# Altium schematic sheet reader.SchDoc
size A3; SheetNumber: 1; SheetTotal: 1
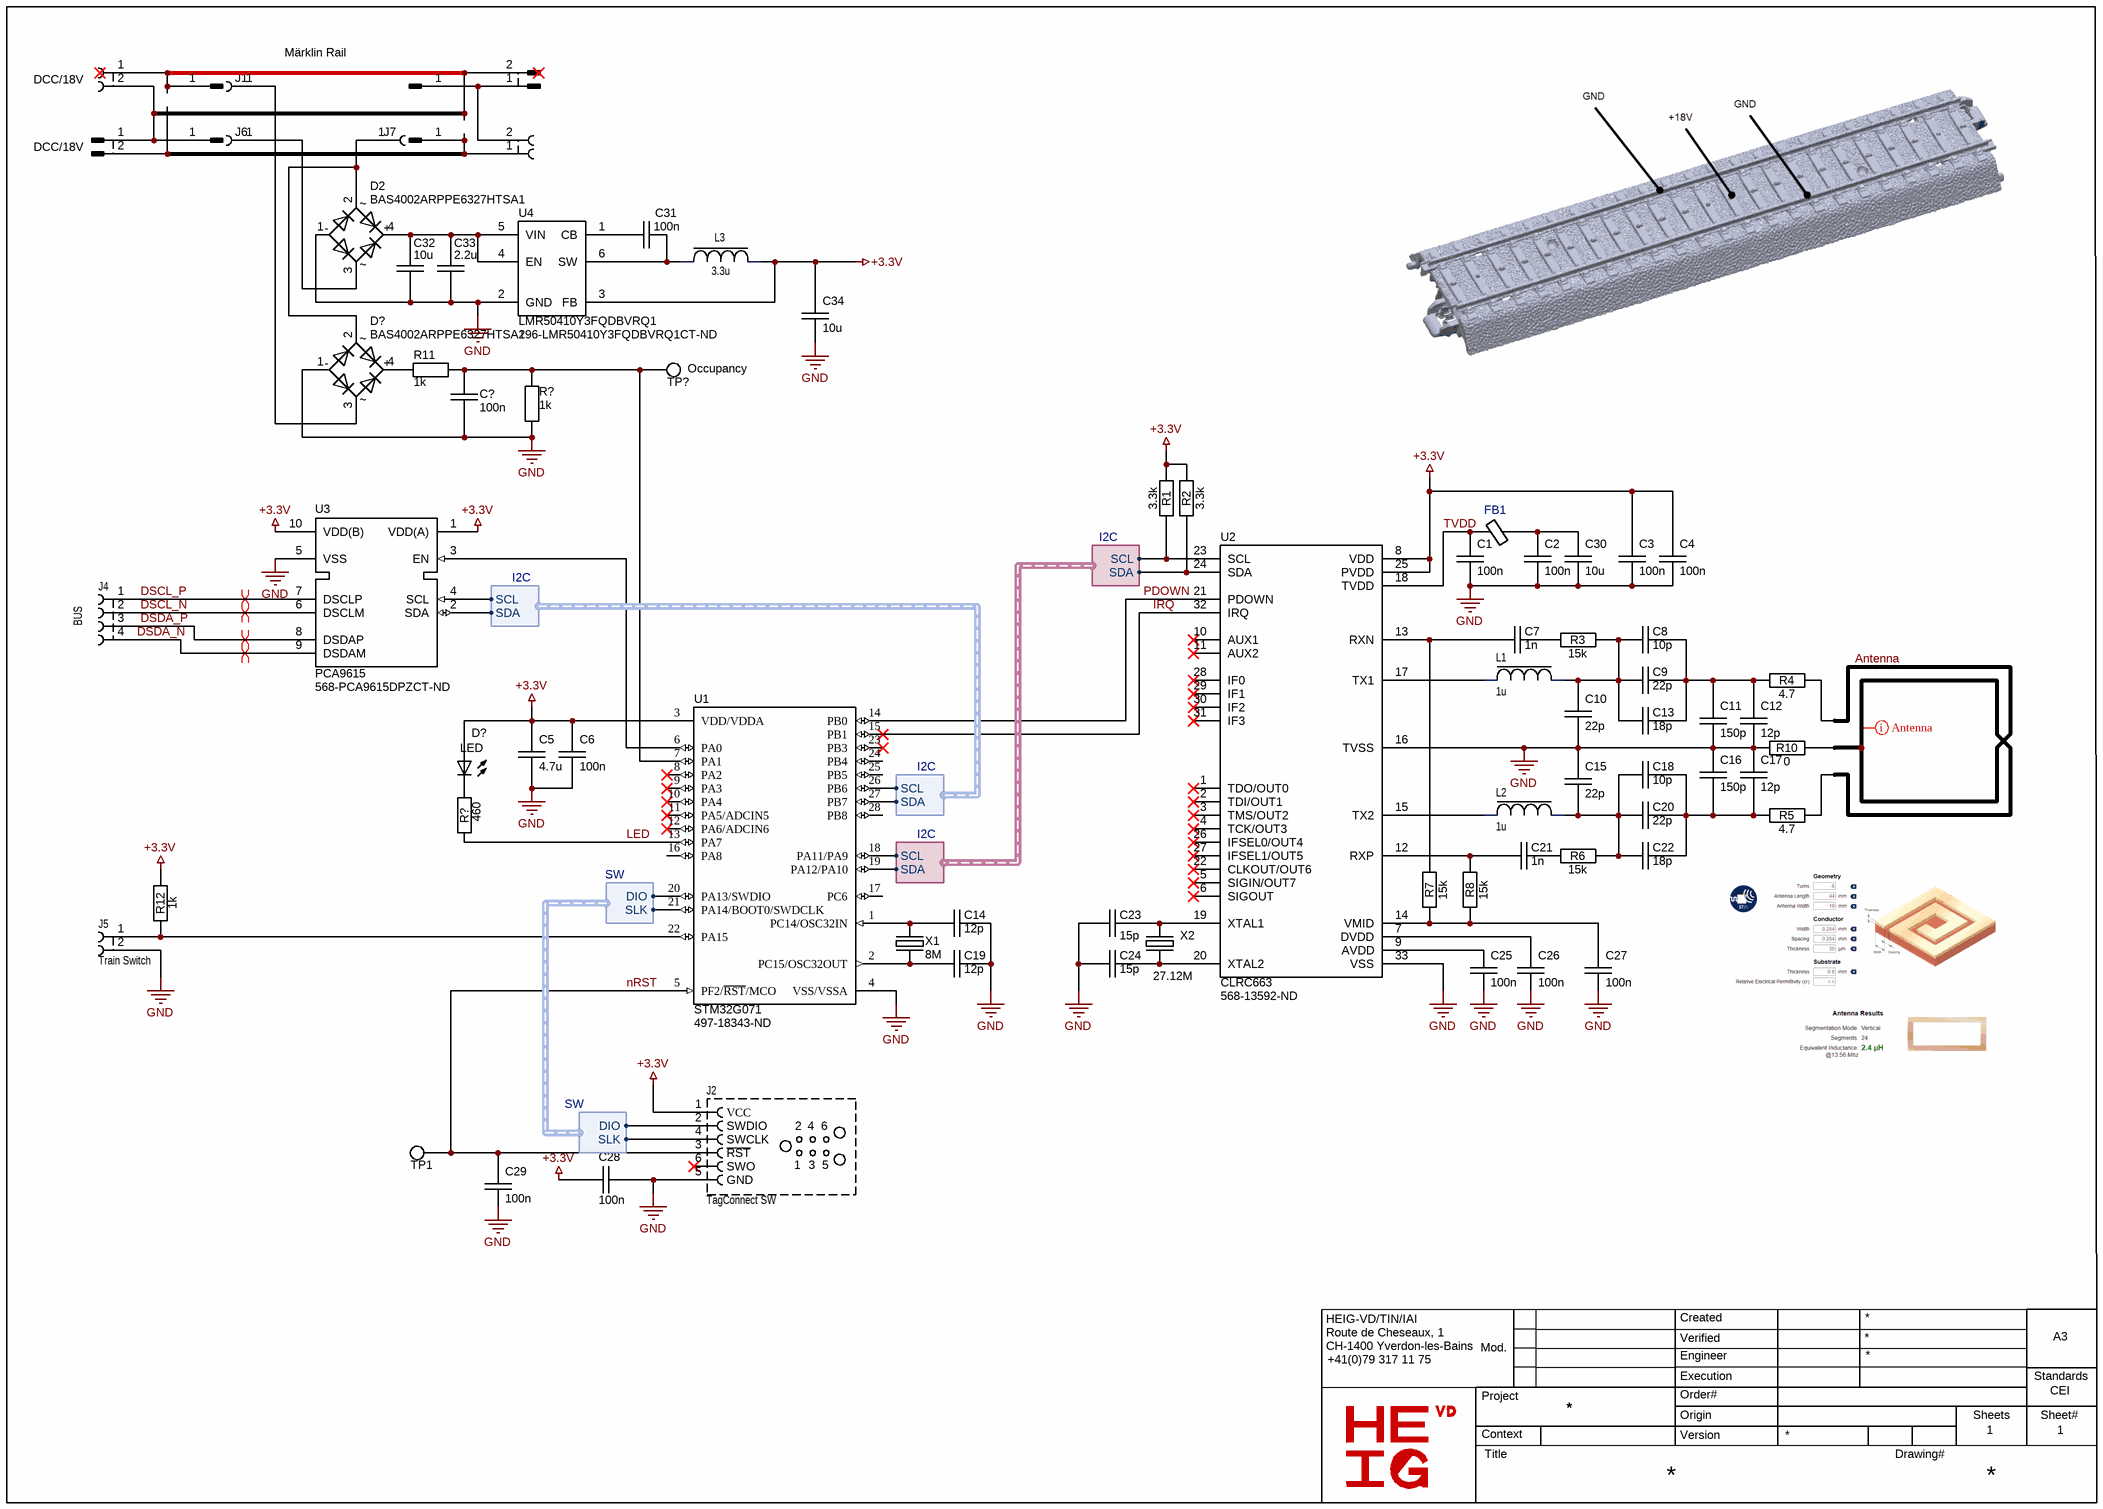
[diagram p0: reader.SchDoc]

## Parts
(Parts that share a designator on the sheet are numbered #1, #2 ... from top to bottom, then left to right.)
C1  100n  [SM/C0603]
C2  100n  [SM/C0603]
C3  100n  [SM/C0603]
C4  100n  [SM/C0603]
C5  4.7u  [SM/C0603]
C6  100n  [SM/C0603]
C7  1n  [SM/C0603]
C8  10p  [SM/C0603]
C9  22p  [SM/C0603]
C10  22p  [SM/C0603]
C11  150p  [SM/C0603]
C12  12p  [SM/C0603]
C13  18p  [SM/C0603]
C14  12p  [SM/C0603]
C15  22p  [SM/C0603]
C16  150p  [SM/C0603]
C17  12p  [SM/C0603]
C18  10p  [SM/C0603]
C19  12p  [SM/C0603]
C20  22p  [SM/C0603]
C21  1n  [SM/C0603]
C22  18p  [SM/C0603]
C23  15p  [SM/C0603]
C24  15p  [SM/C0603]
C25  100n  [SM/C0603]
C26  100n  [SM/C0603]
C27  100n  [SM/C0603]
C28  100n  [SM/C0603]
C29  100n  [SM/C0603]
C30  10u  [SM/C0805]
C31  100n  [SM/C0603]
C32  10u  [SM/C0805]
C33  2.2u  [SM/C0603]
C34  10u  [SM/C0603]
C?  100n  [SM/C0603]
D2  BAS4002ARPPE6327HTSA1  [SOT143-4]
D?#1  BAS4002ARPPE6327HTSA1  [SOT143-4]
D?#2  LED  [SM/LED0603]
FB1  250@1MHz  [SM/L0603]  (value not drawn)
J1  CONN 1 Socket  (value not drawn)
J2  TagConnect SW  [TC2030-IDC-NL]
J4  BUS
J5  Train Switch  [CONN/PIN2]
J6  CONN 1 Socket  (value not drawn)
J7  CONN 1 Socket  (value not drawn)
L1  1u  [SM/L0603]
L2  1u  [SM/L0603]
L3  3.3u  [SM/L0805]
P1  DCC  (value not drawn)  (mechanical)
P2  CONN 2 Plug  (value not drawn)  (mechanical)
P3  CONN 1 Plug  (value not drawn)  (mechanical)
P4  CONN 1 Plug  (value not drawn)  (mechanical)
P5  CONN 1 Plug  (value not drawn)  (mechanical)
P6  CONN 1 Plug  (value not drawn)  (mechanical)
P7  CONN 2 Plug  (value not drawn)  (mechanical)
P8  DCC  [CONN/PIN2]  (value not drawn)  (mechanical)
R1  3.3k  [SM/R0603]
R2  3.3k  [SM/R0603]
R3  15k  [SM/R0603]
R4  4.7  [SM/R0603]
R5  4.7  [SM/R0603]
R6  15k  [SM/R0603]
R7  15k  [SM/R0603]
R8  15k  [SM/R0603]
R10  0  [SM/R0603]
R11  1k  [SM/R0603]
R12  1k  [SM/R0603]
R?#1  1k  [SM/R0603]
R?#2  460  [SM/R0603]
TP1  TP  [TP]  (value not drawn)
TP?  Occupancy  [TP]
U1  STM32G071  Supplier Part Number 1: 497-18343-ND  [FP-UFQFPN28-A0B0-MFG]
U2  CLRC663  Supplier Part Number 1: 568-13592-ND  [QFN50P500X500X100-33N]
U3  PCA9615  Supplier Part Number 1: 568-PCA9615DPZCT-ND
U4  LMR50410Y3FQDBVRQ1  Supplier Part Number 1: 296-LMR50410Y3FQDBVRQ1CT-ND  [SOT23-6]
X1  8M  [RT3215-32.768-12.5]
X2  27.12M  [RT3215-32.768-12.5]

## Harnesses
I2C: SCL, SDA
SW: DIO, SLK

## Nets
+3.3V: C3.2 C4.2 C5.2 C6.2 C28.2 C34.2 D?#2.1 J2.1(VCC) L3.1 R1.2 R2.2 R12.2 U1.3(VDD/VDDA) U2.8(VDD) U2.25(PVDD) U3.1(VDD(A)) U3.10(VDD(B)) U4.3(FB)
GND: C1.1 C2.1 C3.1 C4.1 C5.1 C6.1 C10.1 C11.1 C12.1 C14.1 C15.2 C16.2 C17.2 C19.1 C23.1 C24.1 C25.1 C26.1 C27.1 C28.1 C29.1 C30.1 C32.1 C33.1 C34.1 C?.2 D2.1(-) D?#1.1(-) J2.5(GND) J5.2 R10.2 R?#1.2 U1.4(VSS/VSSA) U2.16(TVSS) U2.33(VSS) U3.5(VSS) U4.2(GND)
Antenna: R4.1 R5.1 R10.1
DSCL_N: J4.2 U3.6(DSCLM)
DSCL_P: J4.1 U3.7(DSCLP)
DSDA_N: J4.4 U3.9(DSDAM)
DSDA_P: J4.3 U3.8(DSDAP)
IRQ: U1.15(PB1) U2.32(IRQ)
LED: R?#2.1 U1.13(PA7)
nRST: C29.2 J2.3(~{RST}) TP1.1 U1.5(PF2/~{RST}/MCO)
PDOWN: U1.14(PB0) U2.21(PDOWN)
TVDD: C1.2 FB1.2 U2.18(TVDD)
NetC2_2: C2.2 C30.2 FB1.1
NetC7_1: C7.1 R3.2
NetC7_2: C7.2 R7.2 U2.13(RXN)
NetC8_1: C8.1 C9.1 C11.2 C12.2 C13.1 R4.2
NetC8_2: C8.2 C9.2 C10.2 C13.2 L1.1 R3.1
NetC14_2: C14.2 U1.1(PC14/OSC32IN) X1.2
NetC15_1: C15.1 C18.2 C20.2 C22.2 L2.1 R6.1
NetC16_1: C16.1 C17.1 C18.1 C20.1 C22.1 R5.2
NetC19_2: C19.2 U1.2(PC15/OSC32OUT) X1.1
NetC21_1: C21.1 R6.2
NetC21_2: C21.2 R8.2 U2.12(RXP)
NetC23_2: C23.2 U2.19(XTAL1) X2.2
NetC24_2: C24.2 U2.20(XTAL2) X2.1
NetC25_2: C25.2 U2.9(AVDD)
NetC26_2: C26.2 U2.7(DVDD)
NetC27_2: C27.2 R7.1 R8.1 U2.14(VMID)
NetC31_1: C31.1 L3.2 U4.6(SW)
NetC31_2: C31.2 U4.1(CB)
NetC32_2: C32.2 C33.2 D2.4(+) U4.4(EN) U4.5(VIN)
NetC?_1: C?.1 R11.1 R?#1.1 TP?.1 U1.7(PA1)
NetD2_2: D2.2 D?#1.2 J7.1
NetD2_3: D2.3 J6.1
NetD?#1_3: D?#1.3 J1.1
NetD?#1_4: D?#1.4(+) R11.2
NetD?#2_2: D?#2.2 R?#2.2
NetJ2_2: J2.2(SWDIO) U1.20(PA13/SWDIO) ; harness SW.DIO
NetJ2_4: J2.4(SWCLK) U1.21(PA14/BOOT0/SWDCLK) ; harness SW.SLK
NetJ5_1: J5.1 R12.1 U1.22(PA15)
NetL1_2: L1.2 U2.17(TX1)
NetL2_2: L2.2 U2.15(TX2)
NetP1_1: P1.1 P1.2 P2.1 P3.1 P4.1 P7.2
NetP2_2: P2.2 P6.1 P8.1
NetP5_1: P5.1 P7.1 P8.2
NetR1_1: R1.1 U1.18(PA11/PA9) U2.23(SCL) ; harness I2C.SCL
NetR2_1: R2.1 U1.19(PA12/PA10) U2.24(SDA) ; harness I2C.SDA
NetU1_6: U1.6(PA0) U3.3(EN)
NetU1_26: U1.26(PB6) U3.4(SCL) ; harness I2C.SCL
NetU1_27: U1.27(PB7) U3.2(SDA) ; harness I2C.SDA

Not connected (* = marked no-connect by the designer): J2 6(SWO)*; U1 8(PA2)* 9(PA3)* 10(PA4)* 11(PA5/ADCIN5)* 12(PA6/ADCIN6)* 16(PA8) 17(PC6) 23(PB3)* 24(PB4) 25(PB5) 28(PB8); U2 1(TDO/OUT0)* 2(TDI/OUT1)* 3(TMS/OUT2)* 4(TCK/OUT3)* 5(SIGIN/OUT7)* 6(SIGOUT)* 10(AUX1)* 11(AUX2)* 22(CLKOUT/OUT6)* 26(IFSEL0/OUT4)* 27(IFSEL1/OUT5)* 28(IF0)* 29(IF1)* 30(IF2)* 31(IF3)*

## Layout directives
differential pair: DSCL_N, DSCL_P, DSDA_N, DSDA_P
rule Clearance Constraint [Clearance = 0.004mm]: Antenna

## Notes on the sheet
- (near J1) Märklin Rail
- (near P1) DCC/18V
- (near P2) DCC/18V
- HEIG-VD/TIN/IAI
- Created
- Route de Cheseaux, 1
- CH-1400 Yverdon-les-Bains
- +41(0)79 317 11 75
- Mod.
- Verified
- Engineer
- Execution
- Standards
- CEI
- A3
- Context
- Project
- Title
- Order#
- Origin
- Version
- Drawing#
- Sheets
- Sheet#

## Library data of the parts
C1-C34 C? = C: Chip Capacitor; Voltage: 16V; Dielectric: X7R
  C1-C4 C6 C25-C29 C31 C?: Value: 100n
  C5: Value: 4.7u
  C7 C21: Value: 1n
  C8 C18: Value: 10p
  C9 C10 C15 C20: Value: 22p
  C11 C16: Value: 150p
  C12 C14 C17 C19: Value: 12p
  C13 C22: Value: 18p
  C23 C24: Value: 15p
  C30 C32 C34: Value: 10u
  C33: Value: 2.2u
D2 D?#1 = BAS4002ARPPE6327HTSA1: Bridge Rectifier Single Phase Schottky 40 V Surface Mount PG-SOT-143-3D
D?#2 = LED: Value: 150060SS75000; Supplier 1: Digi-Key; Supplier Part Number 1: 732-4979-1-ND
FB1 = FB0603: Value: MI0603L301R-10; Supplier 1: Digi-Key; Supplier Part Number 1: 240-2374-1-ND
J2 = CONN 6 / TagConnect
J4 = CONN 4 Socket
J5 P1 P8 = CONN 2 Socket
L1-L3 = L: Isat: *
  L1 L2: Value: 1u
  L3: Value: 3.3u
R1-R8 R10-R12 R?#1 R?#2 = R: Chip Resistor SMD
  R1 R2: Value: 3.3k
  R3 R6-R8: Value: 15k
  R4 R5: Value: 4.7
  R10: Value: 0
  R11 R12 R?#1: Value: 1k
  R?#2: Value: 460
TP1 TP? = TP: Test Point
U3 = PCA9615: 2-channel multipoint Fast-mode Plus differential I2C-bus / buffer with hot-swap logic; Supplier 1: Digi-Key
U4 = LMR50410-Q1: Buck Switching Regulator IC Positive Fixed 3.3V 1 Output 1A SOT-23-6; Supplier 1: Digi-Key
X1 X2 = XTAL: Value: RT3215-32.768-12.5; Supplier 1: Digi-Key; Supplier Part Number 1: 2151-RT3215-32.768-12.5-TRCT-ND
U1 = STM32G071: Supplier 1: Digi-Key
U2 = CLRC663: Supplier 1: Digi-Key